# EAGLE design robot_base (EAGLE 8.4.1)
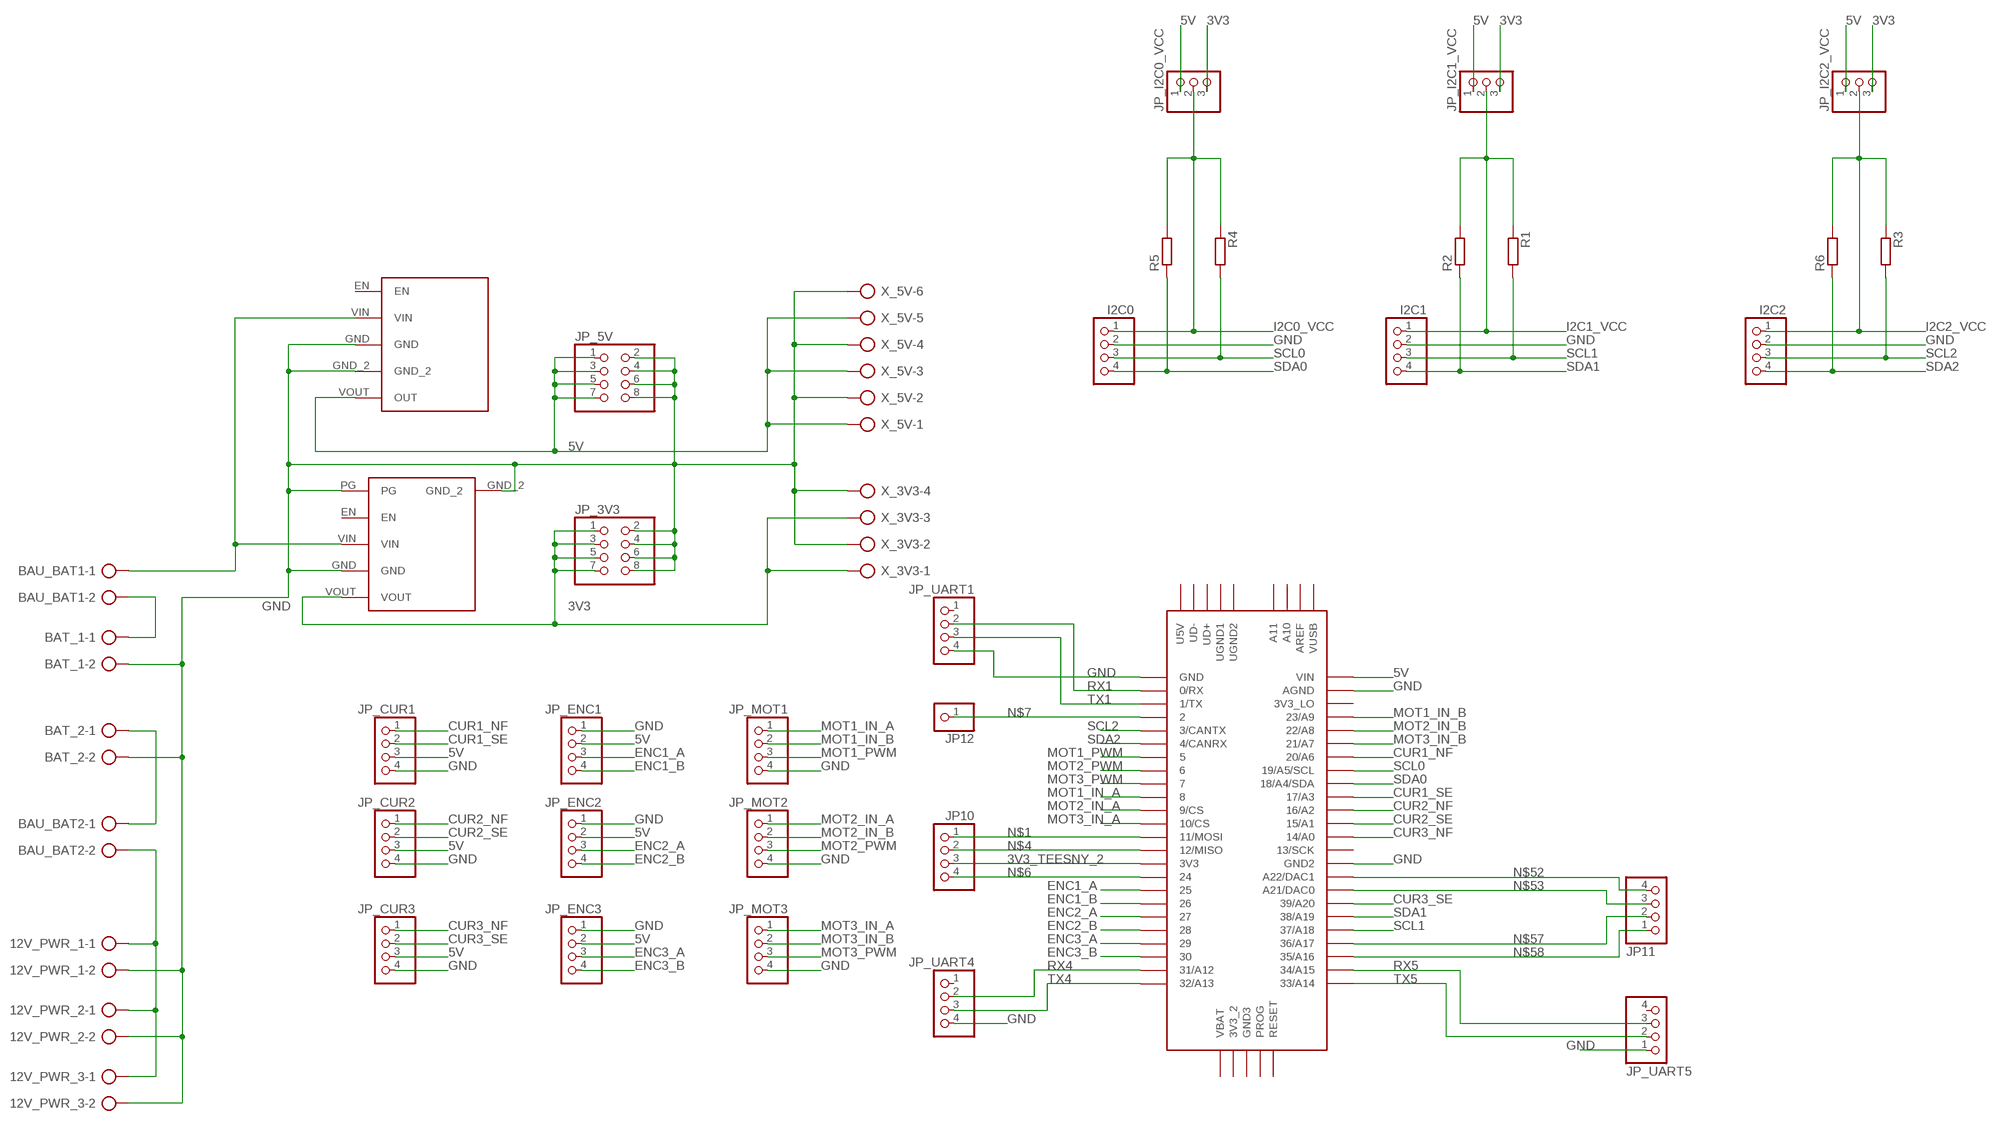
[diagram p0: schematic, sheet 1]

## Parts
12V_PWR_1  AK500/2  [AK500/2]
12V_PWR_2  AK500/2  [AK500/2]
12V_PWR_3  AK500/2  [AK500/2]
BAT_1  AK500/2  [AK500/2]
BAT_2  AK500/2  [AK500/2]
BAU_BAT1  AK500/2  [AK500/2]
BAU_BAT2  AK500/2  [AK500/2]
D24V22F3  D24V22F3  [D24V22F3]
D24V50F5  D24V50F5  [D24V50F5]
I2C0  PINHD-1X4  [1X04]
I2C1  PINHD-1X4  [1X04]
I2C2  PINHD-1X4  [1X04]
JP10  PINHD-1X4  [1X04]
JP11  PINHD-1X4  [1X04]
JP12  PINHD-1X1  [1X01]
JP_3V3  PINHD-2X4  [2X04]
JP_5V  PINHD-2X4  [2X04]
JP_CUR1  PINHD-1X4  [1X04]
JP_CUR2  PINHD-1X4  [1X04]
JP_CUR3  PINHD-1X4  [1X04]
JP_ENC1  PINHD-1X4  [1X04]
JP_ENC2  PINHD-1X4  [1X04]
JP_ENC3  PINHD-1X4  [1X04]
JP_I2C0_VCC  PINHD-1X3  [1X03]
JP_I2C1_VCC  PINHD-1X3  [1X03]
JP_I2C2_VCC  PINHD-1X3  [1X03]
JP_MOT1  PINHD-1X4  [1X04]
JP_MOT2  PINHD-1X4  [1X04]
JP_MOT3  PINHD-1X4  [1X04]
JP_UART1  PINHD-1X4  [1X04]
JP_UART4  PINHD-1X4  [1X04]
JP_UART5  PINHD-1X4  [1X04]
R1  R-EU_0204/5  [0204/5]
R2  R-EU_0204/5  [0204/5]
R3  R-EU_0204/5  [0204/5]
R4  R-EU_0204/5  [0204/5]
R5  R-EU_0204/5  [0204/5]
R6  R-EU_0204/5  [0204/5]
U$1  TEENSY_3.5/3.6TEENSY_3.5/3.6_LONG_PADS  [TEENSY_3.5/3.6]
X_3V3  AK300/4  [AK300/4]
X_5V  AK300/6  [AK300/6]

## Nets
3V3: D24V22F3.VOUT JP_3V3.1 JP_3V3.3 JP_3V3.5 JP_3V3.7 JP_I2C0_VCC.3 JP_I2C1_VCC.3 JP_I2C2_VCC.3 X_3V3.1 X_3V3.3
3V3_TEESNY_2: JP10.3 U$1.3V3
5V: D24V50F5.VOUT(OUT) JP_5V.1 JP_5V.3 JP_5V.5 JP_5V.7 JP_CUR1.3 JP_CUR2.3 JP_CUR3.3 JP_ENC1.2 JP_ENC2.2 JP_ENC3.2 JP_I2C0_VCC.1 JP_I2C1_VCC.1 JP_I2C2_VCC.1 U$1.VIN X_5V.1 X_5V.3 X_5V.5
CUR1_NF: JP_CUR1.1 U$1.20/A6
CUR1_SE: JP_CUR1.2 U$1.17/A3
CUR2_NF: JP_CUR2.1 U$1.16/A2
CUR2_SE: JP_CUR2.2 U$1.15/A1
CUR3_NF: JP_CUR3.1 U$1.14/A0
CUR3_SE: JP_CUR3.2 U$1.39/A20
ENC1_A: JP_ENC1.3 U$1.25
ENC1_B: JP_ENC1.4 U$1.26
ENC2_A: JP_ENC2.3 U$1.27
ENC2_B: JP_ENC2.4 U$1.28
ENC3_A: JP_ENC3.3 U$1.29
ENC3_B: JP_ENC3.4 U$1.30
GND: 12V_PWR_1.2 12V_PWR_2.2 12V_PWR_3.2 BAT_1.2 BAT_2.2 D24V22F3.GND D24V22F3.GND_2 D24V22F3.PG D24V50F5.GND D24V50F5.GND_2 I2C0.2 I2C1.2 I2C2.2 JP_3V3.2 JP_3V3.4 JP_3V3.6 JP_3V3.8 JP_5V.2 JP_5V.4 JP_5V.6 JP_5V.8 JP_CUR1.4 JP_CUR2.4 JP_CUR3.4 JP_ENC1.1 JP_ENC2.1 JP_ENC3.1 JP_MOT1.4 JP_MOT2.4 JP_MOT3.4 JP_UART1.4 JP_UART4.4 JP_UART5.1 U$1.AGND U$1.GND U$1.GND2 X_3V3.2 X_3V3.4 X_5V.2 X_5V.4 X_5V.6
I2C0_VCC: I2C0.1 JP_I2C0_VCC.2 R4.1 R5.2
I2C1_VCC: I2C1.1 JP_I2C1_VCC.2 R1.1 R2.2
I2C2_VCC: I2C2.1 JP_I2C2_VCC.2 R3.1 R6.2
MOT1_IN_A: JP_MOT1.1 U$1.8
MOT1_IN_B: JP_MOT1.2 U$1.23/A9
MOT1_PWM: JP_MOT1.3 U$1.5
MOT2_IN_A: JP_MOT2.1 U$1.9/CS
MOT2_IN_B: JP_MOT2.2 U$1.22/A8
MOT2_PWM: JP_MOT2.3 U$1.6
MOT3_IN_A: JP_MOT3.1 U$1.10/CS
MOT3_IN_B: JP_MOT3.2 U$1.21/A7
MOT3_PWM: JP_MOT3.3 U$1.7
N$1: JP10.1 U$1.11/MOSI
N$2: 12V_PWR_1.1 12V_PWR_2.1 12V_PWR_3.1 BAU_BAT2.2
N$3: BAT_2.1 BAU_BAT2.1
N$4: JP10.2 U$1.12/MISO
N$5: BAU_BAT1.1 D24V22F3.VIN D24V50F5.VIN
N$6: JP10.4 U$1.24
N$7: JP12.1 U$1.2
N$8: BAT_1.1 BAU_BAT1.2
N$52: JP11.4 U$1.A22/DAC1
N$53: JP11.3 U$1.21/DAC0(A21/DAC0)
N$57: JP11.2 U$1.36/A17
N$58: JP11.1 U$1.35/A16
RX1: JP_UART1.2 U$1.0/RX
RX4: JP_UART4.2 U$1.31/A12
RX5: JP_UART5.3 U$1.34/A15
SCL0: I2C0.3 R4.2 U$1.19/A5/SCL
SCL1: I2C1.3 R1.2 U$1.37/A18
SCL2: I2C2.3 R3.2 U$1.3/CANTX
SDA0: I2C0.4 R5.1 U$1.18/A4/SDA
SDA1: I2C1.4 R2.1 U$1.38/A19
SDA2: I2C2.4 R6.1 U$1.4/CANRX
TX1: JP_UART1.3 U$1.1/TX
TX4: JP_UART4.3 U$1.32/A13
TX5: JP_UART5.2 U$1.33/A14
Unconnected: D24V22F3.EN D24V50F5.EN JP_UART1.1 JP_UART4.1 JP_UART5.4 U$1.3V3_2 U$1.3V3_LO U$1.13/SCK U$1.A10 U$1.A11 U$1.AREF U$1.GND3 U$1.PROG U$1.RESET U$1.U5V U$1.UD+ U$1.UD- U$1.UGND1 U$1.UGND2 U$1.VBAT U$1.VUSB

## Library data of the parts
12V_PWR_1-12V_PWR_3 BAT_1 BAT_2 BAU_BAT1 BAU_BAT2 = con-ptr500:AK500/2: CONNECTOR; OC_FARNELL: unknown; OC_NEWARK: unknown
D24V22F3 = D24V22F3:D24V22F3
D24V50F5 = D24V50F5:D24V50F5
I2C0 I2C1 I2C2 JP10 JP11 JP_CUR1-JP_CUR3 JP_ENC1-JP_ENC3 JP_MOT1-JP_MOT3 JP_UART1 JP_UART4 JP_UART5 = pinhead:PINHD-1X4: PIN HEADER
JP12 = pinhead:PINHD-1X1: PIN HEADER
JP_3V3 JP_5V = pinhead:PINHD-2X4: PIN HEADER
JP_I2C0_VCC JP_I2C1_VCC JP_I2C2_VCC = pinhead:PINHD-1X3: PIN HEADER
R1-R6 = rcl:R-EU_: RESISTOR, European symbol
U$1 = Teensy356:TEENSY_3.5/3.6
X_3V3 = con-ptr500:AK300/4: CONNECTOR; OC_FARNELL: unknown; OC_NEWARK: unknown
X_5V = con-ptr500:AK300/6: CONNECTOR; OC_FARNELL: unknown; OC_NEWARK: unknown

## Board
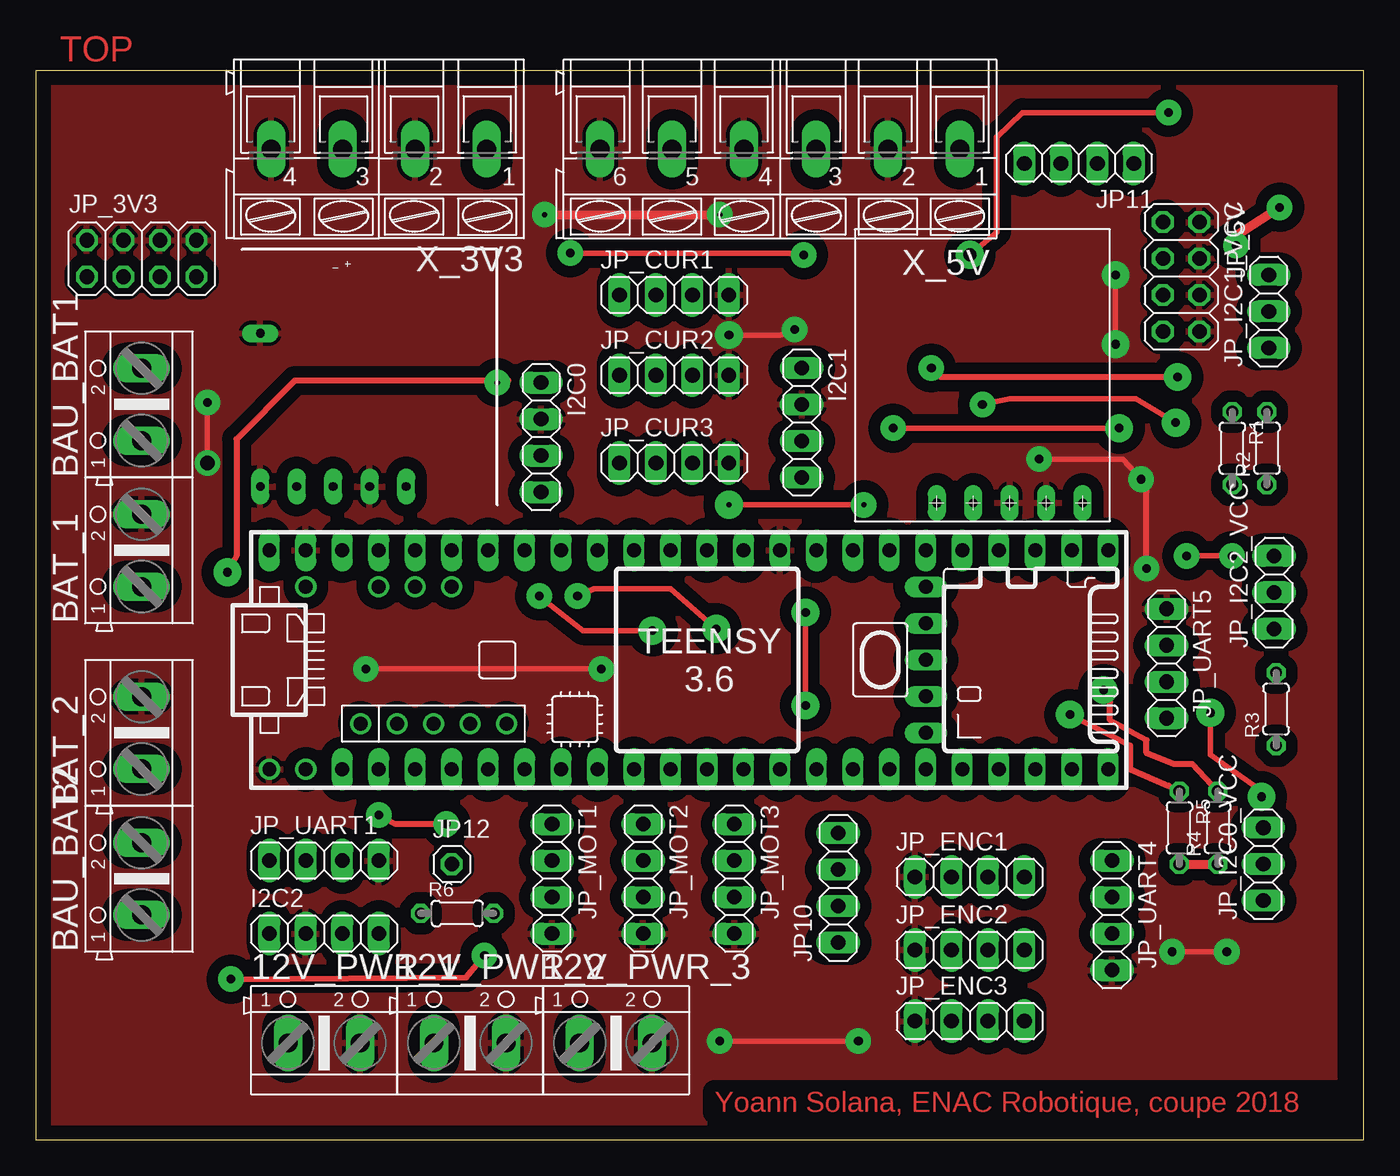
[diagram p1: board, top side]
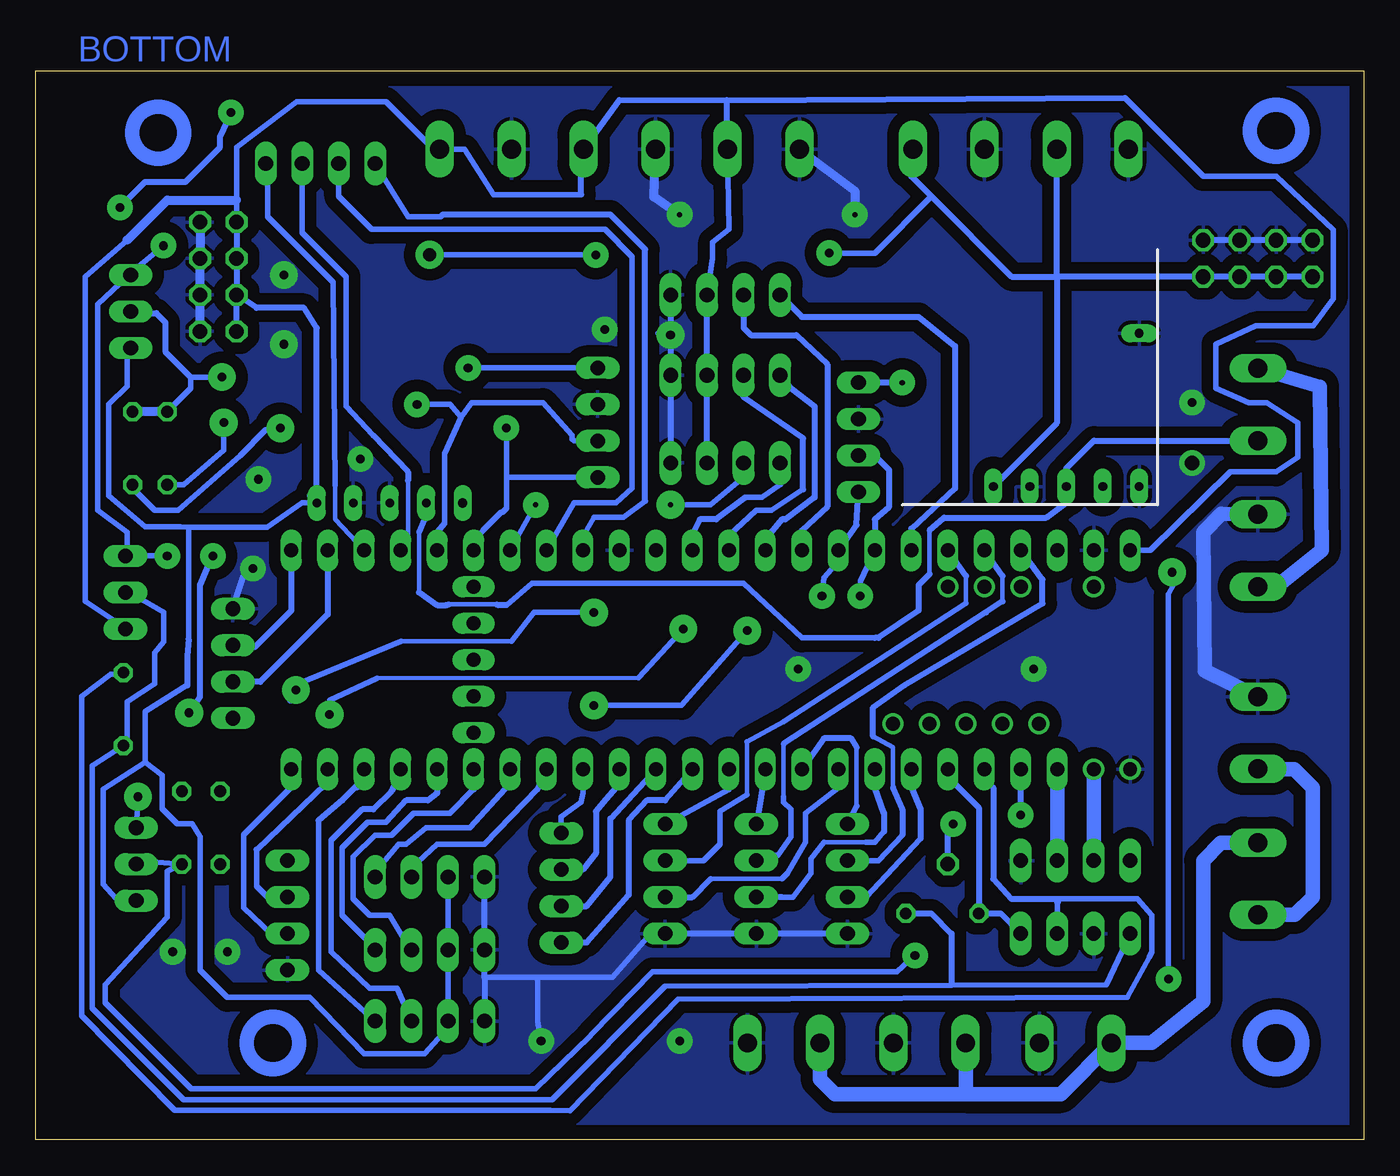
[diagram p2: board, bottom side, seen from below]

Size 92.46 x 74.41 mm. Coordinates in mm from the lower left corner, seen from the top.
Outline: 0,0 92.46,0 92.46,74.41 0,74.41 0,0
Copper layers (1*16): Top 0.035mm / dielectric 1.5mm / Bottom 0.035mm
Design rules: minimum track width 15mil, minimum drill 0.35mm, track to track 15mil, track to pad 15mil, pad to pad 10mil, via to via 6mil, smd to smd 6mil, copper to edge 40mil, drill to drill 6mil, minimum pad ring 10mil, minimum via ring 8mil, stop-mask expansion 4mil, vias tented up to drill 0mil, thermal gap 10mil

### Footprints (pad centres in the part's own frame; a part is rotated, then mirrored left to right if it is on the bottom)
AK500/2 = drill 1.321 long: 1 -2.515,0; 2 2.515,0
D24V22F3 = drill 0.6 pad 1.27 long: EN 3.81,1.27; GND 8.89,1.27; GND_2 1.27,11.938; PG 1.27,1.27; VIN 6.35,1.27; VOUT 11.43,1.27
D24V50F5 = drill 0.65 pad 1.27 long: EN 0,0 | drill 0.6 pad 1.27 long: GND 5.08,0; GND_2 7.62,0; VIN 2.54,0; VOUT 10.16,0
1X04 = drill 1.016 long: 1 -3.81,0; 2 -1.27,0; 3 1.27,0; 4 3.81,0
1X01 = drill 1.016 octagon: 1 0,0
2X04 = drill 1.016 octagon: 1 -3.81,-1.27; 2 -3.81,1.27; 3 -1.27,-1.27; 4 -1.27,1.27; 5 1.27,-1.27; 6 1.27,1.27; 7 3.81,-1.27; 8 3.81,1.27
1X03 = drill 1.016 long: 1 -2.54,0; 2 0,0; 3 2.54,0
0204/5 = drill 0.813 octagon: 1 -2.54,0; 2 2.54,0
TEENSY_3.5/3.6 = drill 0.965 pad 1.422: 0/RX -25.4,-7.62; A10 -17.78,5.08; A11 -15.24,5.08; AREF -20.32,5.08; GND -27.94,-7.62; U5V -21.59,-4.445; UD+ -16.51,-4.445; UD- -19.05,-4.445; UGND1 -13.97,-4.445; UGND2 -11.43,-4.445; VUSB -25.4,5.08 | drill 0.965 pad 1.27 long: 1/TX -22.86,-7.62; 2 -20.32,-7.62; 3/CANTX -17.78,-7.62; 3V3 7.62,-7.62; 3V3_LO -22.86,7.62; 4/CANRX -15.24,-7.62; 5 -12.7,-7.62; 6 -10.16,-7.62; 7 -7.62,-7.62; 8 -5.08,-7.62; 9/CS -2.54,-7.62; 10/CS 0,-7.62; 11/MOSI 2.54,-7.62; 12/MISO 5.08,-7.62; 13/SCK 5.08,7.62; 14/A0 2.54,7.62; 15/A1 0,7.62; 16/A2 -2.54,7.62; 17/A3 -5.08,7.62; 18/A4/SDA -7.62,7.62; 19/A5/SCL -10.16,7.62; 20/A6 -12.7,7.62; 21/A7 -15.24,7.62; 21/DAC0 12.7,7.62; 22/A8 -17.78,7.62; 23/A9 -20.32,7.62; 24 10.16,-7.62; 25 12.7,-7.62; 26 15.24,-7.62; 27 17.78,-7.62; 28 20.32,-7.62; 29 22.86,-7.62; 30 25.4,-7.62; 31/A12 27.94,-7.62; 32/A13 30.48,-7.62; 33/A14 30.48,7.62; 34/A15 27.94,7.62; 35/A16 25.4,7.62; 36/A17 22.86,7.62; 37/A18 20.32,7.62; 38/A19 17.78,7.62; 39/A20 15.24,7.62; A22/DAC1 10.16,7.62; AGND -25.4,7.62; GND2 7.62,7.62; RESET 17.78,5.08; VBAT 17.78,-5.08; VIN -27.94,7.62 | drill 0.965 long: 3V3_2 17.78,-2.54; GND3 17.78,0; PROG 17.78,2.54
AK300/4 = drill 1.321 long: 1 -7.493,0; 2 -2.515,0; 3 2.515,0; 4 7.493,0
AK300/6 = drill 1.321 long: 1 -12.522,0; 2 -7.518,0; 3 -2.515,0; 4 2.515,0; 5 7.518,0; 6 12.522,0

### Placement (x,y rotation side)
12V_PWR_1  20.07,6.73 0 top
12V_PWR_2  30.23,6.73 0 top
12V_PWR_3  40.39,6.73 0 top
BAT_1  7.37,41.02 90 top
BAT_2  7.37,28.32 90 top
BAU_BAT1  7.37,51.18 90 top
BAU_BAT2  7.37,18.16 90 top
D24V22F3  14.35,44.2 0 top
D24V50F5  62.74,44.32 0 top
I2C0  35.18,48.9 270 top
I2C1  53.34,49.91 270 top
I2C2  20.07,14.35 0 top
JP10  55.88,17.53 90 top
JP11  72.64,67.94 180 top
JP12  28.96,19.18 0 top
JP_3V3  7.37,61.34 0 top
JP_5V  79.76,60.07 270 top
JP_CUR1  44.45,58.8 0 top
JP_CUR2  44.45,53.21 0 top
JP_CUR3  44.45,47.12 0 top
JP_ENC1  65.02,18.29 0 top
JP_ENC2  65.02,13.21 0 top
JP_ENC3  65.02,8.25 0 top
JP_I2C0_VCC  85.47,19.18 90 top
JP_I2C1_VCC  85.85,57.66 90 top
JP_I2C2_VCC  86.23,38.1 90 top
JP_MOT1  35.94,18.16 270 top
JP_MOT2  42.29,18.16 270 top
JP_MOT3  48.64,18.16 270 top
JP_UART1  20.07,19.43 0 top
JP_UART4  74.93,15.62 270 top
JP_UART5  78.74,33.15 270 top
R1  83.31,48.13 270 top
R2  85.72,48.13 90 top
R3  86.36,29.97 90 top
R4  82.3,21.72 90 top
R5  79.63,21.72 270 top
R6  29.34,15.75 0 top
U$1  44.2,33.4 0 top
X_3V3  23.88,68.96 180 top
X_5V  51.82,68.96 180 top

### Tracks (layer width: path | path; a pad name or v marks a point on that pad's centre or on a via)
3V3  (via drill 0.6 pad 1.78, 0.6 pad 1.93, 0.9 pad 1.93)
  Top 0.381: v37.21,61.72 53.34,61.72 v53.47,61.59 | v65.03,61.59 66.92,63.17 | 66.92,69.79 68.71,71.5 v78.87,71.5 | v83.31,40.64 v80.14,40.64 | v81.79,29.72 81.79,26.8 84.84,24.64 v85.34,23.88
  Top 0.406: 66.92,63.17 66.92,69.79
  Top 0.61: v83.57,62.23 83.44,62.87 v86.61,64.9
  Bottom 0.381: 86.11,60.07 88.14,58.17 88.14,43.81 86.11,42.29 86.11,41.02 JP_I2C2_VCC.3 v83.31,40.64 | 86.11,60.07 JP_I2C1_VCC.3 | 30.1,65.66 34.04,61.72 v37.21,61.72 | v53.47,61.59 v65.03,61.59 | 84.84,66.67 v86.61,64.9 | v83.57,62.23 85.72,60.45 86.11,60.07 | v85.34,23.88 JP_I2C0_VCC.3
  Bottom 0.406: JP_3V3.1 JP_3V3.3 JP_3V3.5 JP_3V3.7 21.36,60.07 | D24V22F3.VOUT 21.36,49.89 21.36,60.07 | 21.36,60.07 X_3V3.3 | X_3V3.1 31.5,68.83 31.5,67.06 30.1,65.66 24.51,60.07 21.36,60.07 | v81.79,29.72 81.03,30.86 81.03,38.61 v80.14,40.64 | 84.84,66.67 82.04,66.67 79.63,69.09 79.63,69.85 v78.87,71.5
3V3_TEESNY_2
  Bottom 0.406: JP10.3 54.36,18.8 53.47,19.94 53.47,22.86 52.7,23.75 51.82,24.77 U$1.3V3
5V
  Bottom 0.381: JP_ENC1.2 JP_ENC2.2 JP_ENC3.2 64.13,8 64.13,7.37 65.41,5.97 69.6,5.97 73.41,9.91 79.12,9.91 81.03,11.81 81.03,21.08 81.57,22.01 82.63,22.01 83.66,23.04 83.66,25.36 84.84,26.29 | 84.84,26.29 87.76,24.38 87.76,17.78 86.87,16.76 JP_I2C0_VCC.1 | 73.41,44.83 D24V50F5.VOUT 73.91,44.32 76.36,42.63 81.83,42.63 | 86.11,62.61 89.03,60.07 89.03,37.47 86.74,35.94 86.11,35.94 JP_I2C2_VCC.1 | JP_I2C1_VCC.1 86.11,54.99 86.11,52.45 87.38,51.18 87.38,44.83 84.84,42.67 82.42,42.67 81.83,42.63 | JP_CUR1.3 45.34,61.34 45.34,62.48 44.2,63.37 X_5V.5 44.2,68.96 | X_5V.1 62.61,68.96 60.58,65.79 54.48,65.79 | U$1.VIN 14.86,41.02 9.27,46.48 6.1,46.48 4.57,47.5 4.57,49.91 6.73,51.31 8,51.31 10.29,52.32 10.29,55.37 7.49,56.64 3.52,56.64 2.12,58.55 2.12,63.33 6.1,67.06 11.18,67.06 16.64,72.52 | 64.52,68.96 X_5V.1 | X_5V.1 64.77,68.96 68.07,72.26 74.29,72.26 78.49,69.09 78.49,65.41 JP_5V.1 | 81.83,42.63 81.83,34.85 | 84.84,29.81 84.84,26.29
  Bottom 0.406: JP_5V.1 JP_5V.3 JP_5V.5 | JP_5V.7 JP_5V.5 | JP_CUR3.3 JP_CUR2.3 JP_CUR1.3 | D24V50F5.VOUT 72.9,56.52 73.79,57.91 77.09,57.91 JP_5V.5 | 81.83,34.85 81.91,33.66 81.91,31.62 84.84,29.81 | 54.48,65.79 54.48,68.81 X_5V.3 51.82,72.39 44.34,72.37 | 44.34,72.37 16.64,72.52 | X_5V.5 44.34,72.37
  Bottom 0.61: 86.11,62.61 83.31,65.41 78.49,65.41
CUR1_NF
  Bottom 0.406: JP_CUR1.1 39.12,57.28 30.99,57.28 28.45,55.24 28.45,45.34 31.5,42.55 U$1.20/A6
CUR1_SE
  Bottom 0.406: JP_CUR1.2 43.18,56.52 42.67,56.01 39.5,56.01 37.34,53.98 37.34,44.07 39.12,42.42 U$1.17/A3
CUR2_NF
  Bottom 0.406: U$1.16/A2 41.66,41.78 40.51,43.18 40.26,43.18 38.23,44.7 38.23,51.05 39.88,52.32 JP_CUR2.1
CUR2_SE
  Bottom 0.381: 42.29,43.81 41.25,43.81 39.04,45.26
  Bottom 0.406: JP_CUR2.2 43.18,51.69 39.04,48.82 39.04,45.26 | 42.29,43.81 44.2,42.04 U$1.15/A1
CUR3_NF
  Bottom 0.381: 40.64,45.59 41.9,44.72 43.04,44.72
  Bottom 0.406: JP_CUR3.1 40.64,45.59 | 43.04,44.72 45.09,43.18 46.23,43.18 46.74,42.16 U$1.14/A0
CUR3_SE  (via drill 0.35 pad 1.78, 0.35 pad 1.93)
  Top 0.381: v57.66,44.2 v48.26,44.2
  Bottom 0.381: U$1.39/A20 v57.66,44.2 | JP_CUR3.2 43.18,46.1 45.47,44.2 v48.26,44.2
ENC1_A
  Bottom 0.381: 61.21,20.57 64.52,20.57 66.29,18.92 JP_ENC1.3
  Bottom 0.406: U$1.25 57.53,24.38 61.21,20.57
ENC1_B
  Bottom 0.381: 62.23,21.72 65.28,21.72 66.67,20.57 67.18,20.57 68.71,18.8 JP_ENC1.4
  Bottom 0.406: U$1.26 59.44,24.77 62.23,21.72
ENC2_A
  Bottom 0.381: 63.63,22.73 66.17,22.73 67.69,21.21 68.83,21.21 70.36,19.68 70.36,16.76 69.21,15.62 67.82,15.62 66.67,13.72 JP_ENC2.3
  Bottom 0.406: U$1.27 61.98,24.38 63.63,22.73
ENC2_B
  Bottom 0.381: JP_ENC2.4 69.21,13.72 71.12,15.62 71.12,20.33 69.35,22.1 68.07,22.1
  Bottom 0.406: U$1.28 64.52,24.13 65.15,23.62 66.67,23.62 68.07,22.1
ENC3_A
  Bottom 0.381: JP_ENC3.3 67.31,10.54 69.21,10.54 71.88,13.08 71.88,20.83
  Bottom 0.406: U$1.29 67.69,24.26 68.96,22.99 69.72,22.99 71.88,20.83
ENC3_B
  Bottom 0.381: JP_ENC3.4 72.77,11.81 72.77,22.23
  Bottom 0.406: U$1.30 70.1,24.51 69.98,24.77 71.12,23.62 72.77,22.23
GND  (via drill 0.35 pad 1.78, 0.6 pad 1.78, 0.6 pad 1.93, 1 pad 1.78)
  Top 0.381: v39.37,32.77 v22.99,32.77 | v57.28,6.86 v47.62,6.86 | v82.93,13.08 v79.12,13.08 | v48.26,56.01 51.82,56.01 v52.83,56.39 | v11.94,51.31 v11.94,47.12 | v69.85,47.37 75.69,47.37 v76.96,45.97 | v75.18,55.37 v75.18,60.2
  Top 0.406: v77.34,39.75 77.34,45.09 v76.96,45.97
  Top 0.61: v35.43,64.39 v47.62,64.39
  Bottom 0.381: 48.26,56.13 49.15,56.13 v48.26,56.01 | JP_MOT3.4 49.65,14.35 52.32,11.3 57.53,11.3 | v57.28,6.86 57.53,8.25 57.53,11.3 | 57.53,11.3 61.21,11.3
  Bottom 0.406: JP_3V3.2 JP_3V3.4 JP_3V3.6 JP_3V3.8 | JP_ENC1.1 JP_ENC2.1 61.21,11.3 JP_ENC3.1 | JP_MOT1.4 JP_MOT2.4 JP_MOT3.4 | JP_CUR1.4 JP_CUR2.4 JP_CUR3.4 | JP_UART5.1 77.98,39.24 v77.34,39.75
  Bottom 0.61: JP_5V.2 JP_5V.4 JP_5V.6 JP_5V.8 | X_5V.6 35.43,66.04 v35.43,64.39 | v47.62,64.39 49.43,65.63 X_5V.4
  Bottom 1.016: BAT_2.2 11.05,32.64 11.18,42.29 9.91,43.56 BAT_1.2
  pour Bottom (isolate 0.813): 0.89,0.76 1.02,73.66 88.9,73.91 90.42,73.91 90.42,0.64
  pour Top (isolate 0.813): 1.02,73.79 90.42,73.79 90.42,0.76 1.02,0.76
I2C0_VCC  (via drill 0.35 pad 1.78, 0.6 pad 1.78, 0.6 pad 1.93)
  Top 0.381: v13.33,39.5 13.33,40.01 | 32.89,52.83 v32.13,52.7
  Top 0.406: 32.89,52.83 18.03,52.83 13.97,48.77 13.97,40.64 v13.33,39.5 | v13.59,11.18 29.97,11.3 v31.24,12.83
  Top 0.61: R5.2 R4.1
  Bottom 0.381: JP_I2C0_VCC.2 85.22,19.43 R4.1 83.31,18.67 83.31,15.49 87.63,10.79 87.63,9.53 81.65,3.56 57.67,3.56 53.88,7.21 53.75,7.33 49.53,11.68 32.51,11.68 v31.24,12.83 | v13.33,39.5 12.83,39.37 13.59,37.97 v13.59,11.18
  Bottom 0.406: v32.13,52.7 I2C0.1
I2C1_VCC  (via drill 0.6 pad 1.78, 0.6 pad 1.93)
  Top 0.406: v79.5,53.09 62.99,53.09 v62.36,53.72
  Bottom 0.381: 85.47,57.53 JP_I2C1_VCC.2 | v79.5,53.09 81.66,53.09 81.66,52.32 R1.1 | I2C1.1 v62.36,53.72
  Bottom 0.406: 85.47,57.53 84.07,57.53 83.44,56.9 83.44,54.86 81.66,53.09
  Bottom 0.61: R1.1 R2.2
I2C2_VCC
  Bottom 0.381: JP_I2C2_VCC.2 85.47,37.85 83.57,36.7 83.57,34.67 84.2,33.91 84.2,31.75 86.11,30.48 86.11,27.69 R3.1 88.52,26.04 88.52,9.14 82.17,2.79 56.52,2.79 48.64,10.67 28.7,10.75 17.91,10.79 I2C2.1
  Bottom 0.406: R6.2 30.1,15.75 28.7,14.35 28.7,10.75
MOT1_IN_A
  Bottom 0.305: 35.31,27.3 35.31,23.24
  Bottom 0.406: 35.31,27.3 35.69,27.94 37.59,27.94 U$1.8 | 35.31,23.24 JP_MOT1.1
MOT1_IN_B
  Bottom 0.305: 32.77,24.51 32.77,27.3 34.16,28.07
  Bottom 0.381: 32.13,21.21 33.78,19.43 35.31,19.43
  Bottom 0.406: 34.67,19.43 35.31,19.43 JP_MOT1.2 | 34.16,28.07 34.16,30.1 32,31.62 22.35,37.34 22.35,38.99 U$1.23/A9 | 32.77,24.51 32.13,22.99 32.13,21.21
MOT1_PWM
  Bottom 0.381: 30.86,20.96 34.67,16.89
  Bottom 0.406: 34.67,16.89 JP_MOT1.3 | U$1.5 31.5,24.51 30.86,22.99 30.86,20.96
MOT2_IN_A
  Bottom 0.406: U$1.9/CS JP_MOT2.1
MOT2_IN_B
  Bottom 0.305: 40.39,27.56 40.39,23.88 | 25.15,39.24 25.15,37.47
  Bottom 0.381: 40.39,23.88 40.39,23.5 39.88,22.99 39.88,21.08 40.77,19.81 41.78,19.81 JP_MOT2.2
  Bottom 0.406: 25.15,39.24 U$1.22/A8 | 25.15,37.47 26.29,36.7 40.39,27.56
MOT2_PWM
  Bottom 0.305: 34.67,20.7 37.59,20.7
  Bottom 0.381: 33.4,21.46 34.04,20.7 34.67,20.7 | 37.59,20.7 38.48,19.56 38.48,18.54 39.75,16.89 40.51,16.89
  Bottom 0.406: 40.51,16.89 JP_MOT2.3 | 33.4,21.46 33.4,22.73 34.04,24.51 U$1.6
MOT3_IN_A
  Bottom 0.406: JP_MOT3.1 44.2,24.38 U$1.10/CS
MOT3_IN_B
  Bottom 0.305: 42.93,24 42.93,27.69 | 27.69,37.34 27.69,39.24
  Bottom 0.381: 42.93,24 44.83,22.86 44.83,20.57 45.97,19.43 JP_MOT3.2 | 42.93,27.69 40.39,29.08 27.69,37.34
  Bottom 0.406: 27.69,39.24 U$1.21/A7
MOT3_PWM
  Bottom 0.305: 45.47,18.16 40.51,18.16
  Bottom 0.381: 40.51,18.16 40.13,18.54 38.86,20.7 38.86,22.73 36.58,24.51
  Bottom 0.406: JP_MOT3.3 46.74,16.89 45.47,18.16 | 36.58,24.51 U$1.7
N$1
  Bottom 0.381: U$1.11/MOSI 48.64,23.62
  Bottom 0.406: 48.64,23.62 49.91,23.62 51.18,22.23 51.18,17.02 54.1,13.72 JP10.1
N$2
  Bottom 1.016: BAU_BAT2.2 9.93,20.68 11.18,19.43 11.18,9.65 14.73,6.73 12V_PWR_1.1 17.55,6.71 21.08,3.17 27.69,3.17 | 12V_PWR_3.1 37.87,4.22 36.83,3.17 27.69,3.17 | 12V_PWR_2.1 27.69,6.71 27.69,3.17
N$3
  Bottom 1.016: BAU_BAT2.1 4.8,15.65 3.56,16.89 3.56,24.51 4.83,25.78 7.34,25.78 BAT_2.1
N$4
  Bottom 0.406: JP10.2 54.1,16.26 52.45,18.29 52.45,22.35 U$1.12/MISO
N$5
  Bottom 0.305: 30.23,42.42 30.23,39.37 | 65.79,42.29 65.79,38.1 | 63.71,37.26 60.36,37.26
  Bottom 0.381: 65.79,42.29 65.41,43.18 D24V50F5.VIN | 34.04,34.93 39.12,34.93 43.18,38.73 57.91,38.73 59.69,37.21
  Bottom 0.406: BAU_BAT1.1 18.77,48.67 20.7,46.74 D24V22F3.VIN 20.7,44.32 22.1,43.31 29.21,43.31 30.23,42.42 | 65.79,38.1 64.52,37.21 63.89,37.21 63.71,37.26 | 60.36,37.26 60.19,37.21 59.69,37.21 | 30.23,39.37 30.99,38.61 30.99,36.83 33.78,34.93 34.04,34.93
N$6
  Bottom 0.381: U$1.24 54.36,24.16 54.37,24.14 54.5,23.5 55.88,22.49 JP10.4
N$7  (via drill 0.6 pad 1.78)
  Top 0.406: v28.58,21.97 25.02,21.97 v23.88,22.61
  Bottom 0.406: JP12.1 28.96,21.72 v28.58,21.97 | v23.88,22.61 U$1.2
N$8
  Bottom 1.016: BAU_BAT1.2 3.05,52.43 2.92,41.02 6.07,38.51 BAT_1.1
N$52
  Bottom 0.381: U$1.A22/DAC1 54.36,41.66 54.25,42.16 53.58,43.34 51.52,43.34 50.04,44.45 | JP11.4 66.55,64.26 64.26,64.26 64.13,64.39
  Bottom 0.406: 64.13,64.39 52.45,64.39 50.04,61.98 50.04,44.45 | 54.36,41.53 U$1.A22/DAC1
N$53
  Bottom 0.381: U$1.21/DAC0 54.99,44.32 52.07,44.32 50.93,45.34 50.93,61.47 52.83,63.37 69.09,63.37 71.37,65.66 JP11.3
N$57
  Bottom 0.305: 66.55,45.88 66.55,41.53 U$1.36/A17
  Bottom 0.381: JP11.2 73.91,63.12 70.87,60.07 70.87,51.05 68.96,49.02
  Bottom 0.406: 68.96,49.02 66.55,46.48 66.55,45.88
N$58
  Bottom 0.305: U$1.35/A16 71.63,43.18 71.63,45.56
  Bottom 0.381: 71.63,45.56 71.75,59.69 76.33,64.26 76.33,66.92 JP11.1
RX1
  Bottom 1.016: U$1.0/RX JP_UART1.2
RX4
  Bottom 0.381: 75.95,16.89 JP_UART4.2 76.33,16.89 77.09,17.65 77.09,20.19 | 72.26,25.78 U$1.31/A12
  Bottom 0.406: 72.26,25.78 72.26,24.77 77.09,20.19
RX5
  Bottom 0.406: U$1.34/A15 72.14,36.58 76.83,31.88 JP_UART5.3
SCL0  (via drill 0.6 pad 1.78, 0.6 pad 1.93)
  Top 0.381: v35.05,37.85 38.1,35.43 v42.93,35.43 | v53.59,30.23 v53.59,36.7
  Top 0.406: R4.2 80.52,26.16 79.25,26.16 77.34,26.93 77.34,27.82 74.8,29.21 74.8,30.48 v74.36,31.3
  Bottom 0.305: 59.33,34.71 67.03,34.71
  Bottom 0.381: U$1.19/A5/SCL 35.05,38.86 v35.05,37.85 | v42.93,35.43 47.5,30.23 v53.59,30.23 | v53.59,36.7 57.77,36.7 59.33,34.71 | 67.03,34.71 74.43,31.63 | v74.36,31.3 74.74,30.54
  Bottom 0.406: U$1.19/A5/SCL 34.04,43.18 33.02,44.07 33.02,46.61 34.04,47.62 I2C0.3 | 74.43,31.63 v74.36,31.3
SCL1  (via drill 0.6 pad 1.78, 0.6 pad 1.93)
  Top 0.381: v65.91,51.18 67.82,51.56 76.58,51.56 v79.38,49.91
  Bottom 0.381: I2C1.3 54.99,48.64 55.12,48.77 55.12,49.02 57.15,51.31 62.1,51.31 62.87,50.29 | v79.38,49.91 79.38,48.01 82.17,45.59 R1.2 | 64.01,42.93 64.01,47.75 62.87,50.29 | v65.91,51.18 63.63,51.18 62.87,50.29
  Bottom 0.406: 64.01,42.93 64.52,42.29 U$1.37/A18
SCL2
  Bottom 0.381: 21.21,16.76 15.75,16.76 14.73,15.62 14.73,13.08 14.93,12.7 16.45,9.91 47.74,9.78 55.24,2.02 56.64,2.03 82.8,2.03 89.28,8.64 89.28,30.86 87.25,32.38 86.87,32.38 R3.2 | 21.34,16.51 I2C2.3
  Bottom 0.406: U$1.3/CANTX 26.42,25.15 25.78,24.51 25.78,18.16 24.51,16.76 21.21,16.76 21.34,16.51
SDA0  (via drill 0.6 pad 1.78, 0.6 pad 1.93)
  Top 0.381: v37.72,37.85 38.86,38.35 44.2,38.35 v47.37,35.56
  Top 0.406: v72.01,29.59 76.2,27.43 76.2,25.78 78.87,24.64 R5.1
  Bottom 0.305: 68.71,32.13 50.51,32.17
  Bottom 0.381: U$1.18/A4/SDA 36.58,40.26 37.59,39.12 v37.72,37.85 | 50.51,32.17 v47.37,35.56 | 68.71,32.13 72.01,30.61 v72.01,29.59
  Bottom 0.406: U$1.18/A4/SDA 35.31,42.8 I2C0.4
SDA1  (via drill 0.6 pad 1.78, 0.6 pad 1.93)
  Top 0.381: v59.69,49.53 v75.44,49.53
  Bottom 0.381: 53.72,46.1 I2C1.4 59.69,46.1 | U$1.38/A19 61.98,41.76 61.33,42.4 61.33,42.42 60.06,43.69 59.94,43.69 59.69,43.94 59.69,46.1 | 59.69,46.1 v59.69,49.53 | v75.44,49.53 76.07,49.4 76.45,49.4 78.23,47.62 82.55,43.81 84.2,43.81 85.72,45.34 R2.1
SDA2
  Bottom 0.406: U$1.4/CANRX 28.96,25.27 26.8,23.11 R6.1 25.27,15.75 I2C2.4
TX1
  Bottom 1.016: JP_UART1.3 U$1.1/TX
TX4
  Bottom 0.381: 76.07,14.35 77.98,16.13 77.98,21.22 74.68,24.52 U$1.32/A13
  Bottom 0.406: 76.07,14.35 JP_UART4.3
TX5
  Bottom 0.406: U$1.33/A14 74.68,36.83 77.22,34.29 78.61,34.29 JP_UART5.2
(copper drawn outside any net)
  shapes: Bottom circle x4

### Text on the board
Top: TOP | Yoann Solana, ENAC Robotique, coupe 2018
Bottom: BOTTOM